# Altium schematic sheet SSSU011700_2021-01-09.schdoc
size 41 x 30 mm
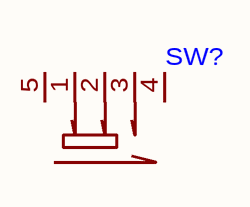
[diagram p0: SSSU011700_2021-01-09.schdoc]

## Parts
SW?  (no value)  [SW-TH_SSSU011700]

## Nets

Not connected (* = marked no-connect by the designer): SW? 1 2 3 4 5

## Library data of the parts
SW? = SSSU011700